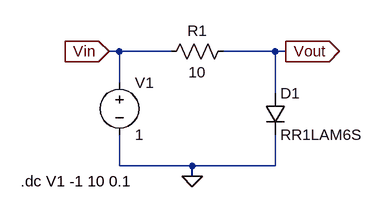
[diagram p0: schematic Draft13.asc]
Draft13.asc, the LTspice schematic file:
Version 4
SHEET 1 880 680
WIRE 16 64 0 64
WIRE 96 64 16 64
WIRE 256 64 176 64
WIRE 272 64 256 64
WIRE 16 112 16 64
WIRE 256 128 256 64
WIRE 16 240 16 192
WIRE 128 240 16 240
WIRE 256 240 256 192
WIRE 256 240 128 240
WIRE 128 256 128 240
FLAG 128 256 0
FLAG 272 64 Vout
IOPIN 272 64 Out
FLAG 0 64 Vin
IOPIN 0 64 In
SYMBOL diode 240 128 R0
SYMATTR InstName D1
SYMATTR Value RR1LAM6S
SYMBOL res 192 48 R90
WINDOW 0 0 56 VBottom 2
WINDOW 3 32 56 VTop 2
SYMATTR InstName R1
SYMATTR Value 10
SYMBOL voltage 16 96 R0
WINDOW 123 0 0 Left 0
WINDOW 39 0 0 Left 0
SYMATTR InstName V1
SYMATTR Value 1
TEXT -136 264 Left 2 !.dc V1 -1 10 0.1

The netlist it stands for:
* Draft13.asc
D1 Vout 0 RR1LAM6S
R1 Vout Vin 10
V1 Vin 0 1
.model D D
.lib standard.dio
.dc V1 -1 10 0.1
.backanno
.end

* Results of the author's LTspice run, read from the files saved beside the schematic
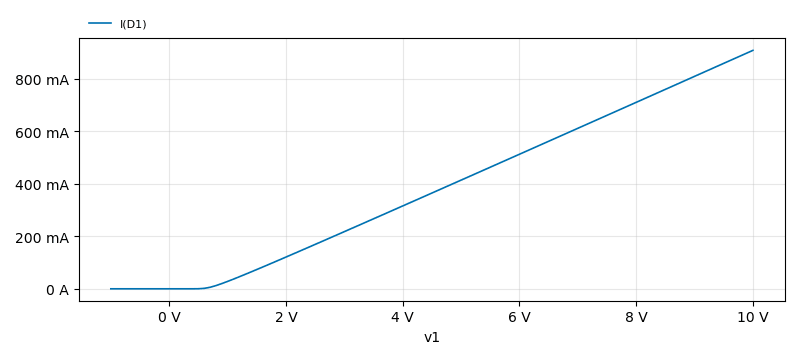
[diagram p1: DC transfer characteristic of Draft13.asc, plotted from the saved traces]
* DC transfer characteristic, 1 run:
*   I(D1): -8.135 nA at v1=-1 V, 907.8 mA at v1=10 V, min -8.135 nA, max 907.8 mA